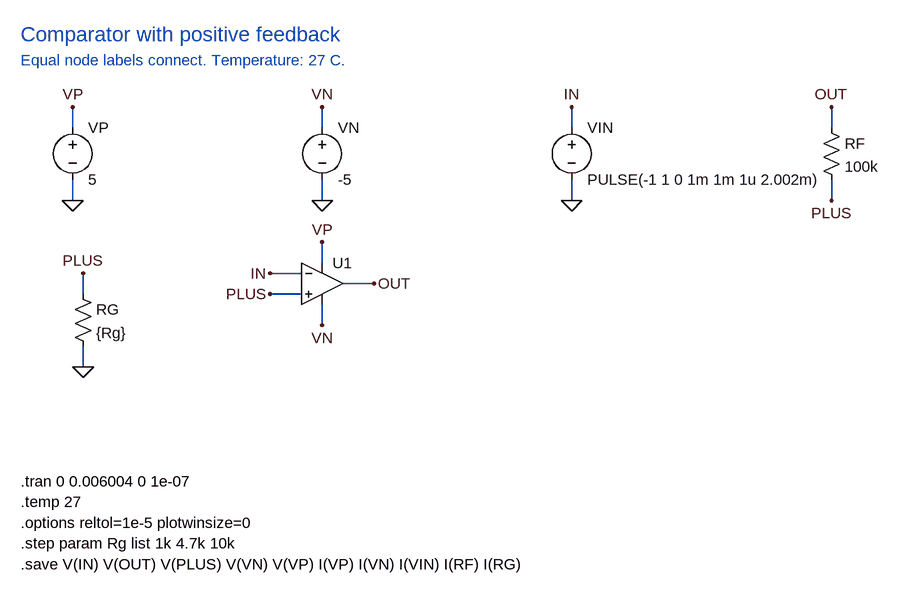
[diagram p0: schematic comparator-hysteresis.asc]
comparator-hysteresis.asc, the LTspice schematic file:
Version 4
SHEET 1 1740 1000
WIRE 144 176 144 144
WIRE 144 256 144 288
WIRE 528 176 528 144
WIRE 528 256 528 288
WIRE 912 176 912 144
WIRE 912 256 912 288
WIRE 1312 176 1312 144
WIRE 1312 256 1312 288
WIRE 160 432 160 400
WIRE 160 512 160 544
WIRE 496 432 448 432
WIRE 496 400 448 400
WIRE 528 384 528 352
WIRE 528 448 528 480
WIRE 560 416 608 416
FLAG 144 144 VP
FLAG 144 288 0
FLAG 528 144 VN
FLAG 528 288 0
FLAG 912 144 IN
FLAG 912 288 0
FLAG 1312 144 OUT
FLAG 1312 288 PLUS
FLAG 160 400 PLUS
FLAG 160 544 0
FLAG 448 432 PLUS
FLAG 448 400 IN
FLAG 528 352 VP
FLAG 528 480 VN
FLAG 608 416 OUT
SYMBOL voltage 144 160 R0
SYMATTR InstName VP
SYMATTR Value 5
SYMBOL voltage 528 160 R0
SYMATTR InstName VN
SYMATTR Value -5
SYMBOL voltage 912 160 R0
SYMATTR InstName VIN
SYMATTR Value PULSE(-1 1 0 1m 1m 1u 2.002m)
SYMBOL res 1296 160 R0
SYMATTR InstName RF
SYMATTR Value 100k
SYMBOL res 144 416 R0
SYMATTR InstName RG
SYMATTR Value {Rg}
SYMBOL OpAmps/UniversalOpamp2 528 416 R0
SYMATTR InstName U1
SYMATTR SpiceModel level2
SYMATTR Value2 Avol=1Meg GBW=10Meg Slew=10Meg
SYMATTR SpiceLine Ilimit=100m Rail=0.5 Vos=0
SYMATTR SpiceLine2 En=0 Enk=0 In=0 Ink=0 Rin=1G
TEXT 64 32 Left 3 ;Comparator with positive feedback
TEXT 64 72 Left 2 ;Equal node labels connect. Temperature: 27 C.
TEXT 64 720 Left 2 !.tran 0 0.006004 0 1e-07
TEXT 64 752 Left 2 !.temp 27
TEXT 64 784 Left 2 !.options reltol=1e-5 plotwinsize=0
TEXT 64 816 Left 2 !.step param Rg list 1k 4.7k 10k
TEXT 64 848 Left 2 !.save V(IN) V(OUT) V(PLUS) V(VN) V(VP) I(VP) I(VN) I(VIN) I(RF) I(RG)

The netlist it stands for:
* comparator-hysteresis.asc
VP VP 0 5
VN VN 0 -5
VIN IN 0 PULSE(-1 1 0 1m 1m 1u 2.002m)
RF OUT PLUS 100k
RG PLUS 0 {Rg}
XU1 PLUS IN VP VN OUT level2 Avol=1Meg GBW=10Meg Slew=10Meg Ilimit=100m Rail=0.5 Vos=0 En=0 Enk=0 In=0 Ink=0 Rin=1G  ; pins In+ In- V+ V- OUT
* Comparator with positive feedback
* Equal node labels connect. Temperature: 27 C.
.tran 0 0.006004 0 1e-07
.temp 27
.options reltol=1e-5 plotwinsize=0
.step param Rg list 1k 4.7k 10k
.save V(IN) V(OUT) V(PLUS) V(VN) V(VP) I(VP) I(VN) I(VIN) I(RF) I(RG)
.lib UniversalOpAmp2.lib
.backanno
.end